# EAGLE design synth_backplane_1 (EAGLE 6.4)
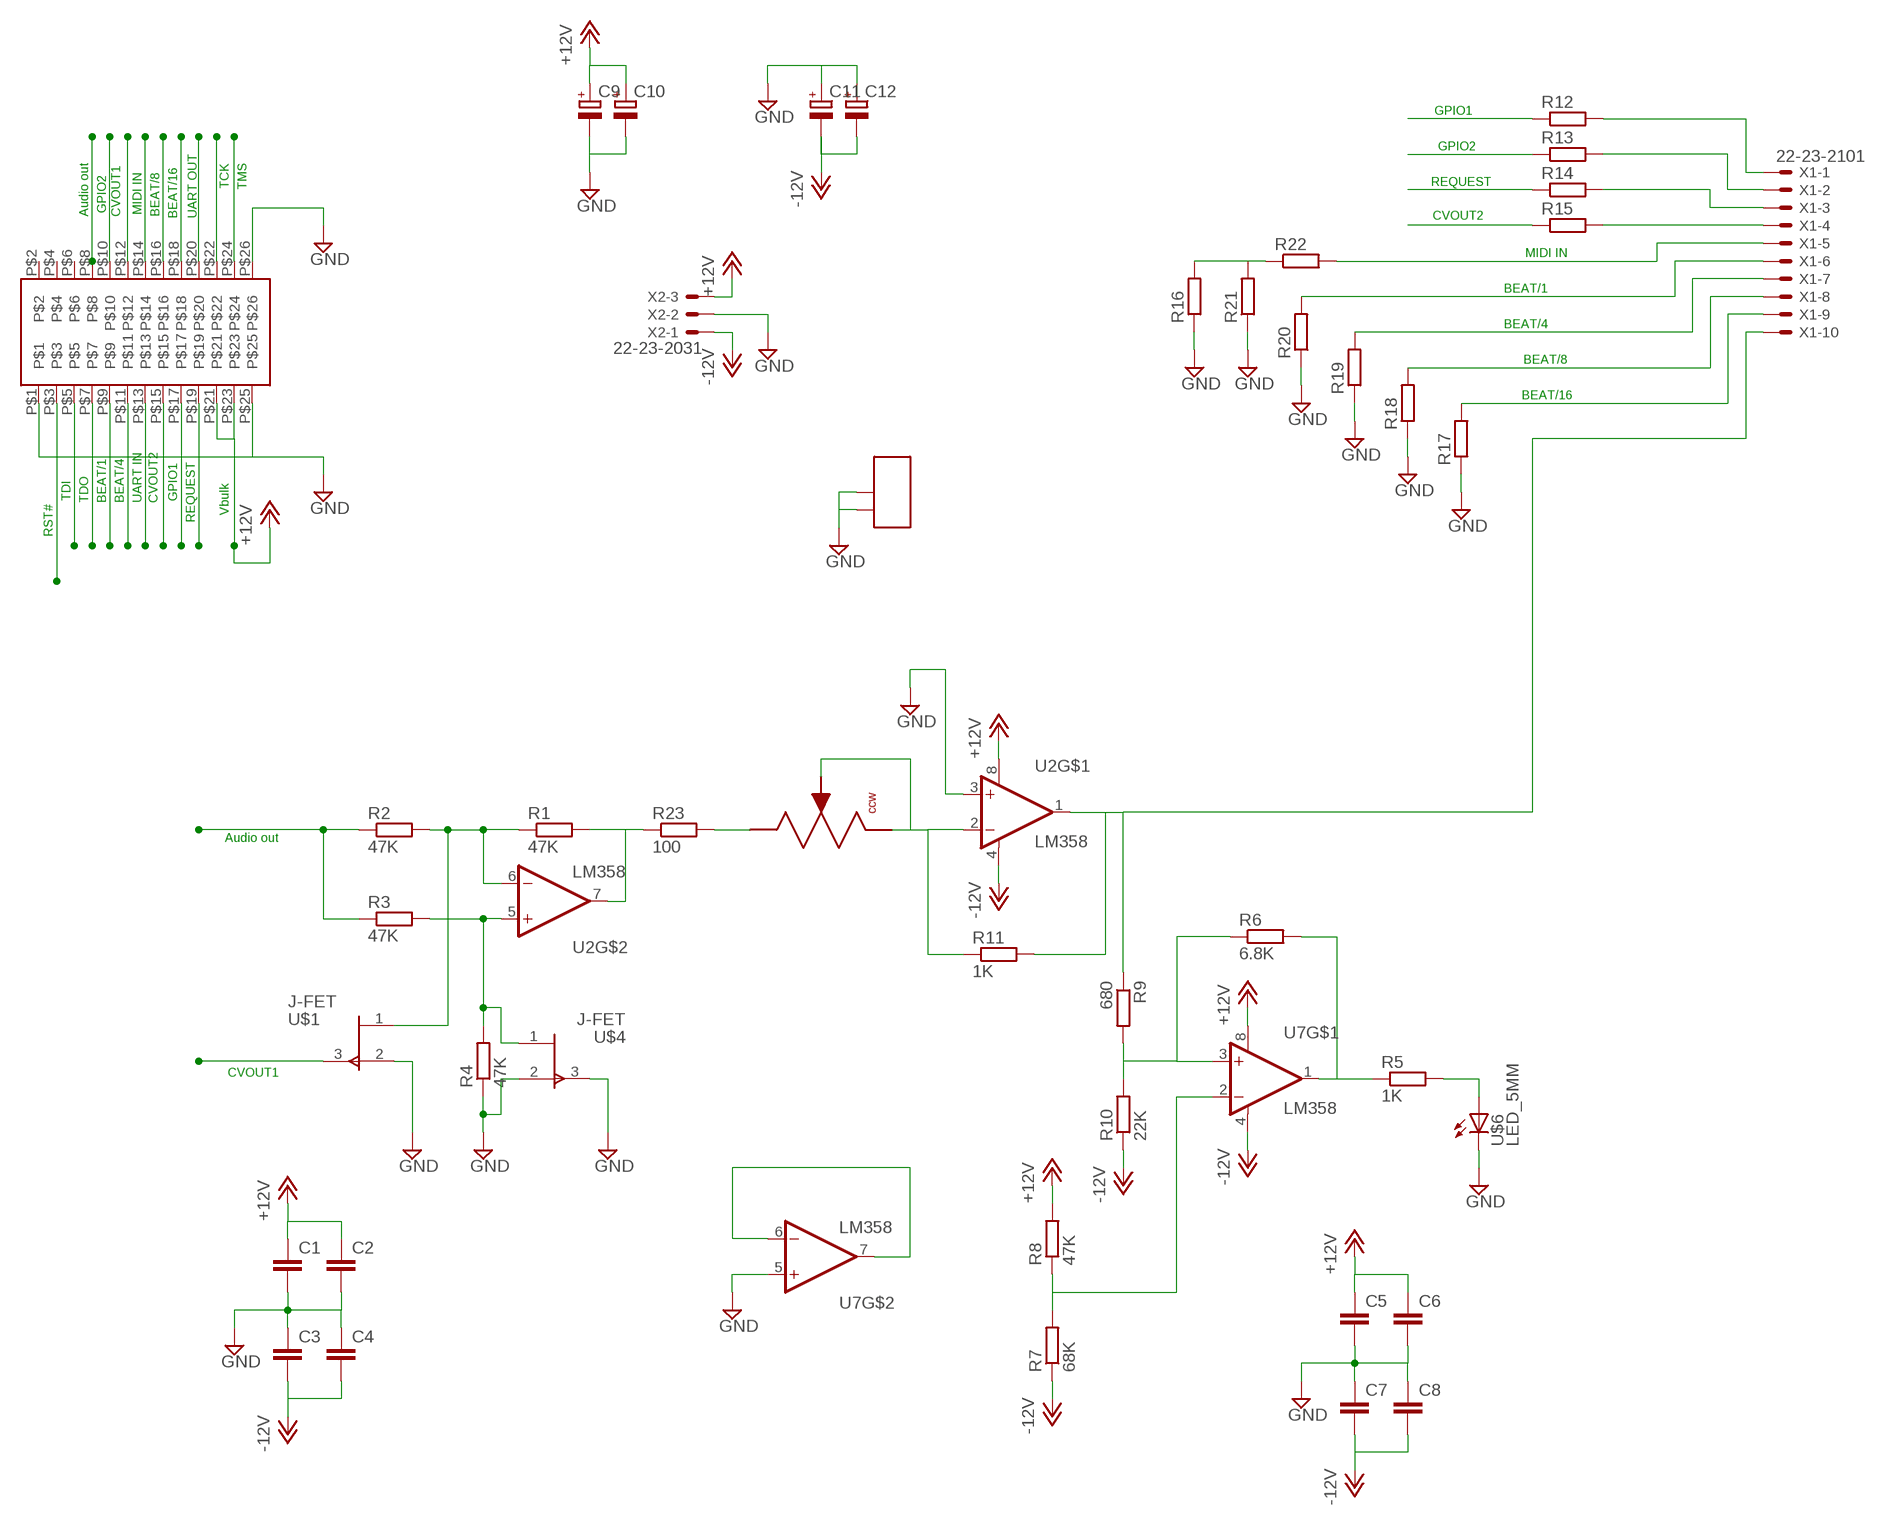
[diagram p0: schematic, sheet 1]

## Parts
C1  C-EUC0603K  [C0603K]
C2  C-EUC0603K  [C0603K]
C3  C-EUC0603K  [C0603K]
C4  C-EUC0603K  [C0603K]
C5  C-EUC0603K  [C0603K]
C6  C-EUC0603K  [C0603K]
C7  C-EUC0603K  [C0603K]
C8  C-EUC0603K  [C0603K]
C9  CPOL-EUSMCE  [SMC_E]
C10  CPOL-EUSMCE  [SMC_E]
C11  CPOL-EUSMCE  [SMC_E]
C12  CPOL-EUSMCE  [SMC_E]
R1  47K  R-EU_R0603  [R0603]
R2  47K  R-EU_R0603  [R0603]
R3  47K  R-EU_R0603  [R0603]
R4  47K  R-EU_R0603  [R0603]
R5  1K  R-EU_R0603  [R0603]
R6  6.8K  R-EU_R0603  [R0603]
R7  68K  R-EU_R0603  [R0603]
R8  47K  R-EU_R0603  [R0603]
R9  680  R-EU_R0603  [R0603]
R10  22K  R-EU_R0603  [R0603]
R11  1K  R-EU_R0603  [R0603]
R12  R-EU_R0603  [R0603]
R13  R-EU_R0603  [R0603]
R14  R-EU_R0603  [R0603]
R15  R-EU_R0603  [R0603]
R16  R-EU_R0603  [R0603]
R17  R-EU_R0603  [R0603]
R18  R-EU_R0603  [R0603]
R19  R-EU_R0603  [R0603]
R20  R-EU_R0603  [R0603]
R21  R-EU_R0603  [R0603]
R22  R-EU_R0603  [R0603]
R23  100  R-EU_R0603  [R0603]
U2  LM358  [SO08]
U7  LM358  [SO08]
U$1  J-FET  [SOT_23]
U$3  TE_EDGECON_26_SOCKET  [TE_EDGE_26_SOCKET]
U$4  J-FET  [SOT_23]
U$5  POT_MODEL_P090  [POT_MODEL_P090]
U$6  LED_5MM  [LED5MM]
X1  22-23-2101  [22-23-2101]
X2  22-23-2031  [22-23-2031]

## Nets
+12V: C1.1 C2.1 C5.1 C6.1 C9.+ C10.+ R8.2 U2.8(V+) U7.8(V+) U$3.P$21 U$3.P$23 X2.3
-12V: C3.2 C4.2 C7.2 C8.2 C11.- C12.- R7.1 R10.1 U2.4(V-) U7.4(V-) X2.1
AUD_OUT: R2.1 R3.1 U$3.P$8
BEAT/1: R20.2 U$3.P$9 X1.6
BEAT/4: R19.2 U$3.P$11 X1.7
BEAT/8: R18.2 U$3.P$16 X1.8
BEAT/16: R17.2 U$3.P$18 X1.9
CVOUT1: U$1.3(G) U$3.P$12
CVOUT2: R15.1 U$3.P$15
GND: C1.2 C2.2 C3.1 C4.1 C5.2 C6.2 C7.1 C8.1 C9.- C10.- C11.+ C12.+ R4.1 R16.1 R17.1 R18.1 R19.1 R20.1 R21.1 U2.3(+IN) U7.5(+IN) U$1.2(S) U$3.P$1 U$3.P$25 U$3.P$26 U$4.2(S) U$4.3(G) U$5.P$4 U$5.P$5 U$6.K(C) X2.2
GPIO1: R12.1 U$3.P$17
GPIO2: R13.1 U$3.P$10
N$2: R23.2 U$5.P$1(R2)
N$4: R5.1 R6.2 U7.1(OUT)
N$5: R5.2 U$6.A
N$6: R6.1 R9.2 R10.2 U7.3(+IN)
N$7: R7.2 R8.1 U7.2(-IN)
N$8: U7.6(-IN) U7.7(OUT)
N$9: R11.1 U2.2(-IN) U$5.P$2(RVAR) U$5.P$3(CCW)
N$10: R12.2 X1.1
N$11: R13.2 X1.2
N$12: R14.2 X1.3
N$13: R15.2 X1.4
N$14: R9.1 R11.2 U2.1(OUT) X1.10
R10: R1.2 R23.1 U2.7(OUT)
REQUEST: R14.1 U$3.P$19
RST#: U$3.P$3
TCK: U$3.P$22
TDI: U$3.P$5
TDO: U$3.P$7
TMS: U$3.P$24
UCA0RXD: R16.2 R21.2 R22.1 U$3.P$14
UCA0RXD_BUS: R22.2 X1.5
UCA1RXD1: U$3.P$13
UCA1TXD: U$3.P$20
VN: R1.1 R2.2 U2.6(-IN) U$1.1(D)
VP: R3.2 R4.2 U2.5(+IN) U$4.1(D)
Unconnected: U$3.P$2 U$3.P$4 U$3.P$6

## Notes on the sheet
- GPIO1
- GPIO2
- TCK | TMS
- REQUEST
- GPIO2 | MIDI IN
- Audio out | CVOUT1 | BEAT/8 | BEAT/16 | UART OUT
- CVOUT2
- MIDI IN
- BEAT/1
- BEAT/4
- BEAT/8
- BEAT/16
- TDI | TDO | BEAT/1 | BEAT/4 | UART IN | CVOUT2 | GPIO1
- Vbulk
- REQUEST
- RST#
- Audio out
- CVOUT1

## Library data of the parts
C1-C8 = rcl:C-EU: CAPACITOR, European symbol
C9-C12 = rcl:CPOL-EU: POLARIZED CAPACITOR, European symbol
R1-R23 = rcl:R-EU_: RESISTOR, European symbol
U2 U7 = synth_design:LM358
U$1 U$4 = synth_design:J-FET: MMBFJ177CT-ND. Drain and source are interchangeable.
U$3 = Custom_headers:TE_EDGECON_26_SOCKET
U$5 = synth_design:POT_MODEL_P090
U$6 = synth_design:LED_5MM
X1 = con-molex:22-23-2101: .100" (2.54mm) Center Header - 10 Pin; MF: MOLEX; MPN: 22-23-2101; OC_FARNELL: 1756828; OC_NEWARK: 94C0765
X2 = con-molex:22-23-2031: .100" (2.54mm) Center Header - 3 Pin; MF: MOLEX; MPN: 22-23-2031; OC_FARNELL: 1462950; OC_NEWARK: 30C0862

## Net classes
1 +12V: clearance 0.406 mm to class 0
2 -12V: clearance 0.406 mm to class 0, clearance 0.406 mm to class 1

## Board
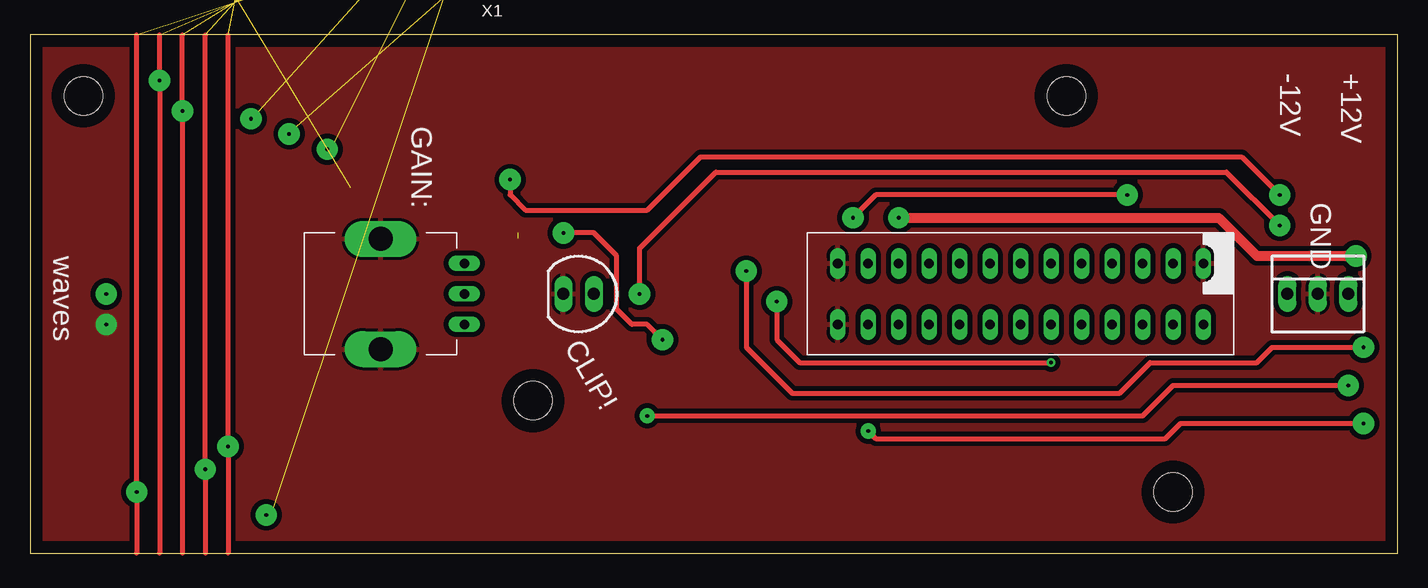
[diagram p1: board, top side]
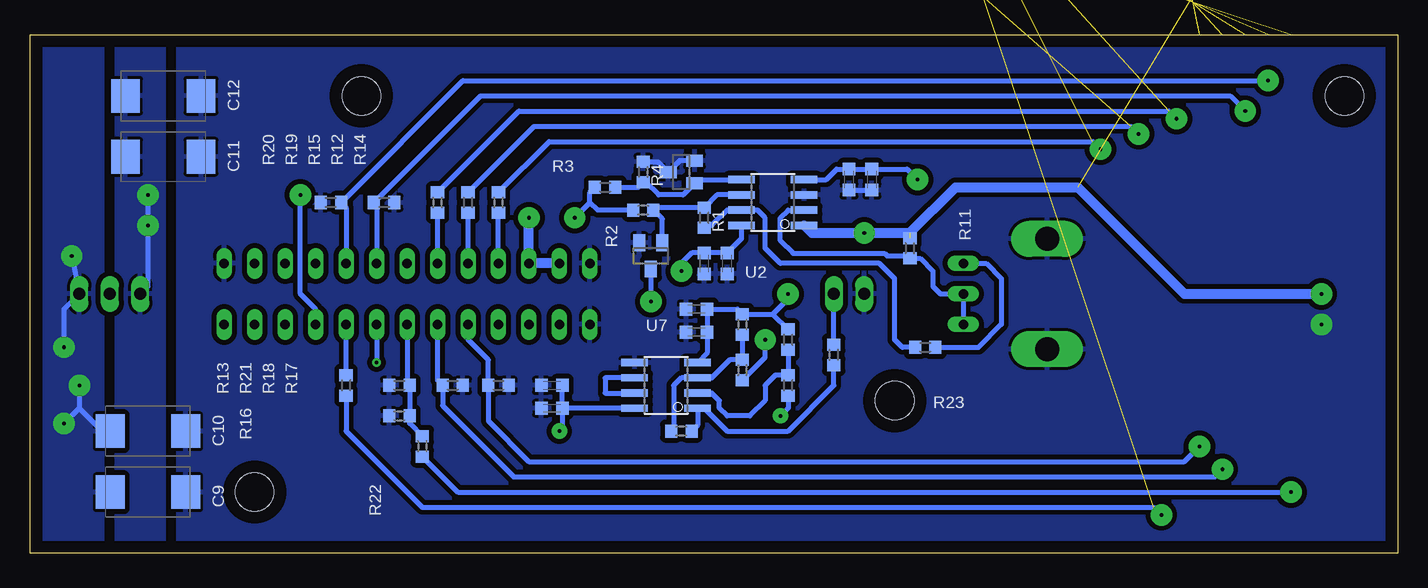
[diagram p2: board, bottom side, seen from below]

Size 113.97 x 43.17 mm. Coordinates in mm from the lower left corner, seen from the top.
Outline: 0,0 113.97,0 113.97,43.17 0,43.17 0,0
Copper layers (1*16): Top 0.035mm / dielectric 1.5mm / Bottom 0.035mm
Design rules "default *": minimum track width 10mil, minimum drill 24mil, track to track 16mil, track to pad 16mil, pad to pad 16mil, via to via 16mil, smd to smd 8mil, copper to edge 40mil, drill to drill 8mil, minimum pad ring 10mil, minimum via ring 8mil, stop-mask expansion 4mil, vias tented up to drill 0mil, thermal gap 10mil
Holes 3.2 mm at 41.91,12.7 86.36,38.1 95.25,5.08 4.45,38.1

### Footprints (pad centres in the part's own frame; a part is rotated, then mirrored left to right if it is on the bottom)
C0603K = smd 1.05 x 1.08: 1 -0.875,0; 2 0.875,0
SMC_E = smd 2.4 x 2.8: + -3.15,0; - 3.15,0
R0603 = smd 1 x 1.1: 1 -0.85,0; 2 0.85,0
SO08 = smd 0.61 x 2.21: 1 -1.905,-2.616; 2 -0.635,-2.616; 3 0.635,-2.616; 4 1.905,-2.616; 5 1.905,2.616; 6 0.635,2.616; 7 -0.635,2.616; 8 -1.905,2.616
SOT_23 = smd 1 x 1.4: 1 -0.95,-1.1; 2 0.95,-1.1; 3 0,1.1
TE_EDGE_26_SOCKET = drill 0.8 long: P$1 -2.54,15.24; P$2 2.54,15.24; P$3 -2.54,12.7; P$4 2.54,12.7; P$5 -2.54,10.16; P$6 2.54,10.16; P$7 -2.54,7.62; P$8 2.54,7.62; P$9 -2.54,5.08; P$10 2.54,5.08; P$11 -2.54,2.54; P$12 2.54,2.54; P$13 -2.54,0; P$14 2.54,0; P$15 -2.54,-2.54; P$16 2.54,-2.54; P$17 -2.54,-5.08; P$18 2.54,-5.08; P$19 -2.54,-7.62; P$20 2.54,-7.62; P$21 -2.54,-10.16; P$22 2.54,-10.16; P$23 -2.54,-12.7; P$24 2.54,-12.7; P$25 -2.54,-15.24; P$26 2.54,-15.24
POT_MODEL_P090 = drill 0.8 long: P$1 -2.54,6.985; P$2 0,6.985; P$3 2.54,6.985 | drill 2 long: P$4 4.597,0; P$5 -4.597,0
LED5MM = drill 1 long: A -1.27,0; K 1.27,0
22-23-2101 = drill 1 long: 1 -11.43,0; 2 -8.89,0; 3 -6.35,0; 4 -3.81,0; 5 -1.27,0; 6 1.27,0; 7 3.81,0; 8 6.35,0; 9 8.89,0; 10 11.43,0
22-23-2031 = drill 1 long: 1 -2.54,0; 2 0,0; 3 2.54,0

### Placement (x,y rotation side)
C1  57.78,24.13 270 bottom
C2  55.88,24.13 270 bottom
C3  45.72,31.11 90 bottom
C4  43.81,31.11 90 bottom
C5  70.48,12.07 180 bottom
C6  70.48,13.97 180 bottom
C7  58.42,20.32 0 bottom
C8  58.42,18.41 0 bottom
C9  104.14,5.08 0 bottom
C10  104.14,10.16 0 bottom
C11  102.87,33.02 180 bottom
C12  102.87,38.1 180 bottom
R1  57.78,27.94 270 bottom
R2  62.86,28.57 0 bottom
R3  66.04,30.48 0 bottom
R4  62.86,31.75 270 bottom
R5  46.99,16.51 90 bottom
R6  59.69,10.16 0 bottom
R7  50.8,17.78 270 bottom
R8  50.8,13.97 270 bottom
R9  54.61,15.24 90 bottom
R10  54.61,19.05 270 bottom
R11  40.64,25.4 90 bottom
R12  77.47,29.21 90 bottom
R13  87.63,13.97 270 bottom
R14  74.93,29.21 90 bottom
R15  80.01,29.21 90 bottom
R16  83.19,11.43 0 bottom
R17  74.93,13.97 180 bottom
R18  78.74,13.97 180 bottom
R19  84.45,29.21 180 bottom
R20  88.9,29.21 0 bottom
R21  83.19,13.97 0 bottom
R22  81.28,8.89 270 bottom
R23  39.37,17.14 0 bottom
U2  52.07,29.21 90 bottom
U7  60.96,13.97 90 bottom
U$1  62.23,24.77 180 bottom
U$3  82.55,21.59 270 top
U$4  59.69,31.75 90 bottom
U$5  29.21,21.59 270 top
U$6  45.72,21.59 180 top
X1  26.67,49.53 180 top  (outside the outline)
X2  107.31,21.59 0 top

### Tracks (layer width: path | path; a pad name or v marks a point on that pad's centre or on a via)
+12V  (via drill 0.3 pad 1.27, 0.3 pad 1.78)
  Top 0.406: v51.44,11.43 92.71,11.43 95.25,13.97 v109.85,13.97 | v69.85,10.16 70.48,9.53 94.61,9.53 95.88,10.8 v111.12,10.8 | v59.69,23.49 59.69,17.14 63.5,13.34 90.8,13.34 93.34,15.88 102.23,15.88 103.5,17.14 v111.12,17.14
  Top 0.813: v72.39,27.94 99.06,27.94 102.23,24.77 v110.49,24.77
  Bottom 0.406: U2.8 54.69,26.2 C2.1 C1.1 58.81,25 59.69,24.13 v59.69,23.49 | U7.8 C5.1 | v110.49,24.77 X2.3 111.12,20.32 v111.12,17.14 | R8.2 50.8,12.07 v51.44,11.43 | v109.85,13.97 109.85,12.07 | 109.85,12.07 107.95,10.16 C10.+ | C5.1 69.61,10.4 v69.85,10.16 | v111.12,10.8 109.85,12.07 | C5.1 C6.1
  Bottom 0.813: v72.39,27.94 U$3.P$21 U$3.P$23
  pour Bottom: 107.95,43.18 114.3,43.18 114.3,0 107.95,0
-12V  (via drill 0.3 pad 1.78)
  Top 0.406: v40,31.11 40,29.84 41.27,28.57 51.44,28.57 55.88,33.02 100.97,33.02 v104.14,29.84 | v50.8,21.59 50.8,25.4 57.15,31.75 99.69,31.75 v104.14,27.3
  Bottom 0.406: U2.4 47.62,31.11 46.75,31.99 C3.2 C4.2 40.88,31.99 v40,31.11 | U7.4 57.55,16.67 C8.2 C7.2 55.03,20.32 R10.1 52.07,19.9 | 52.07,19.9 R7.1 | v50.8,21.59 50.8,21.17 52.07,19.9 | X2.1 104.14,22.22 v104.14,27.3 v104.14,29.84
  pour Bottom: 106.68,43.18 102.87,43.18 102.87,0 106.68,0
AUD_OUT  (via drill 0.3 pad 1.78)
  Top 0.406: v91.44,29.84 70.48,29.84 v68.58,27.94
  Bottom 0.406: R2.1 66.67,28.57 67.31,29.21 | 67.31,29.21 67.31,30.06 R3.1 | U$3.P$8 90.17,20.32 91.44,21.59 v91.44,29.84 | v68.58,27.94 67.31,29.21
BEAT/1  (via drill 0.3 pad 1.78)  (1 unrouted)
  Top 0.406: 10.79,43.18 v10.79,39.37 10.79,0
  Bottom 0.406: v10.79,39.37 77.89,39.37 R20.2 87.63,28.79 U$3.P$9
BEAT/4  (via drill 0.3 pad 1.78)  (1 unrouted)
  Top 0.406: 12.7,43.18 v12.7,36.83 12.7,0
  Bottom 0.406: U$3.P$11 85.09,28.99 R19.2 76.41,38.1 13.97,38.1 v12.7,36.83
BEAT/8  (via drill 0.3 pad 1.78)  (1 unrouted)
  Top 0.406: 14.61,43.18 v14.61,6.99 14.61,0
  Bottom 0.406: U$3.P$16 80.01,14.39 R18.2 79.59,12.28 73.66,6.35 15.24,6.35 v14.61,6.99
BEAT/16  (via drill 0.3 pad 1.78)  (1 unrouted)
  Top 0.406: 16.51,43.18 v16.51,8.89 16.51,0
  Bottom 0.406: U$3.P$18 77.47,17.78 75.78,16.09 R17.2 75.78,11.01 72.39,7.62 17.78,7.62 v16.51,8.89
CVOUT1  (via drill 0.3, 0.3 pad 1.78)
  Top 0.406: v62.23,20.95 62.23,17.78 64.14,15.88 v85.09,15.88
  Bottom 0.406: U$3.P$12 v85.09,15.88 | U$1.3 v62.23,20.95
CVOUT2
  Bottom 0.406: U$3.P$15 R15.1
GND  (via drill 0.3 pad 1.78)
  Bottom 0.406: 45.96,30.24 C3.1 C4.1 | R4.1 61.64,32.6 U$4.3 59.84,32.7 U$4.2
  other vias: 6.35,19.05 6.35,19.05
  pour Bottom: 0,43.18 101.6,43.18 101.6,0 0,0
  pour Top: 0,43.18 0,0 113.66,0 113.66,43.18
GPIO1
  Bottom 0.406: U$3.P$17 R12.1
GPIO2
  Bottom 0.406: R13.1 U$3.P$10
N$1  (via drill 0.3 pad 1.78)
  other vias: 4.45,38.1
N$2
  Bottom 0.406: U$5.P$1 34.29,24.13 33.02,22.86 33.02,19.05 34.92,17.14 R23.2
N$3  (via drill 0.3 pad 1.78)
  other vias: 86.36,38.1
N$4
  Bottom 0.406: R6.2 58.34,10.66 U7.1 57.78,12.07 55.88,10.16 50.8,10.16 46.99,13.97 R5.1
N$5
  Bottom 0.406: R5.2 U$6.A
N$6
  Bottom 0.406: R6.1 60.33,10.38 60.33,13.97 59.69,14.61 U7.3 57.15,14.61 55.67,16.09 R9.2 R10.2
N$7
  Bottom 0.406: R7.2 R8.1 51.86,14.82 52.7,13.97 52.7,12.7 53.97,11.43 55.88,11.43 56.52,12.07 56.52,12.7 57.15,13.34 U7.2
N$8
  Bottom 0.406: U7.6 66.04,14.61 66.04,13.34 U7.7
N$9
  Bottom 0.406: U$5.P$3 U$5.P$2 38.1,21.59 38.73,22.22 38.73,23.49 39.79,24.55 R11.1 41.06,24.77 42.55,24.77 42.76,24.98 50.38,24.98 51.44,26.04 51.44,27.94 50.8,28.57 U2.2
N$10  (via drill 0.3 pad 1.78)  (1 unrouted)
  Top 0.406: v21.59,34.92 21.59,34.29
  Bottom 0.406: R12.2 71.97,35.56 22.23,35.56 v21.59,34.92
N$11  (via drill 0.3 pad 1.78)  (1 unrouted)
  Bottom 0.406: R13.2 87.63,10.16 81.28,3.81 20.32,3.81 v19.69,3.17
N$12  (via drill 0.3 pad 1.78)  (1 unrouted)
  Top 0.406: v24.77,33.66 24.77,33.02
  Bottom 0.406: R14.2 70.7,34.29 25.4,34.29 v24.77,33.66
N$13  (via drill 0.3 pad 1.78)  (1 unrouted)
  Top 0.406: v18.41,36.2 18.41,35.56
  Bottom 0.406: R15.2 73.24,36.83 19.05,36.83 v18.41,36.2
N$14  (via drill 0.3 pad 1.78)  (2 unrouted)
  Top 0.406: v52.7,17.78 51.44,19.05 50.17,19.05 48.89,20.32 48.89,24.77 46.99,26.67 v44.45,26.67
  Bottom 0.406: U2.1 49.53,27.3 | R9.1 52.7,16.3 v52.7,17.78
  Bottom 0.813: U2.1 48.82,26.67 v44.45,26.67 40.64,26.67 36.83,30.48 26.67,30.48 17.78,21.59 v6.35,21.59
N$15  (via drill 0.3 pad 1.78)
  other vias: 41.91,12.7
N$16  (via drill 0.3 pad 1.78)
  other vias: 95.25,5.08
R10
  Bottom 0.406: R1.2 57.57,27.3 57.15,27.3 55.88,28.57 U2.7 53.34,28.57 52.7,27.94 52.7,25.4 51.44,24.13 43.18,24.13 41.91,22.86 41.91,17.78 41.27,17.14 R23.1
REQUEST
  Bottom 0.406: U$3.P$19 R14.1
UCA0RXD
  Bottom 0.406: U$3.P$14 82.55,14.18 R21.2 R16.2 82.33,10.8 R22.1
UCA0RXD_BUS  (via drill 0.3 pad 1.78)  (1 unrouted)
  Top 0.406: 8.89,43.18 v8.89,5.08 8.89,0
  Bottom 0.406: R22.2 78.32,5.08 v8.89,5.08
VN
  Bottom 0.406: U2.6 56.73,29.84 R1.1 61.8,28.79 R2.2 61.28,27.84 U$1.1
VP
  Bottom 0.406: R3.2 63.28,30.48 R4.2 62.65,30.9 61.59,29.84 59.55,29.84 U$4.1 58.28,31.11 U2.5

### Text on the board
tNames: -12V | +12V | GAIN: | GND | waves | CLIP!